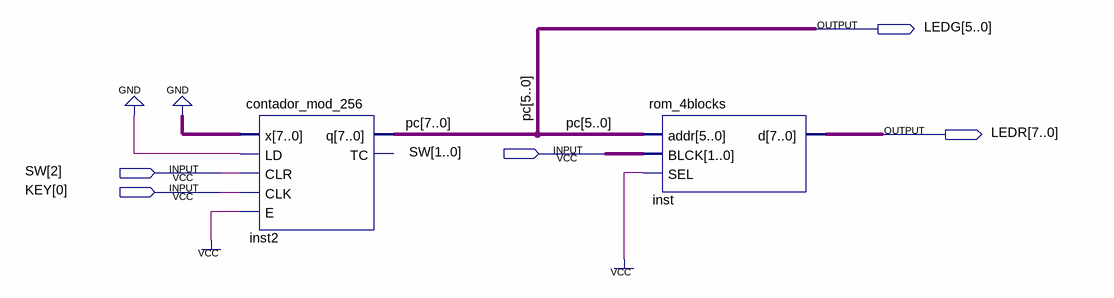
[diagram p0: schematic sheet]
// Quartus schematic teste_ROM.bdf as structural Verilog: 2 symbols, 5 pins
module teste_ROM (
  input  [2:0] SW,
  input  [0:0] KEY,
  output [5:0] LEDG,
  output [7:0] LEDR
);

  wire [7:6] pc;

  contador_mod_256 inst2 (.x({8{1'b0}}), .LD(1'b0), .CLR(SW[2]), .CLK(KEY[0]), .E(1'b1), .q({pc, LEDG}));  // open: TC
  rom_4blocks inst (.addr(LEDG), .SEL(1'b1), .BLCK(SW[1:0]), .d(LEDR));

  // Other names for the same wires on the sheet: pc[5:0] = LEDG
endmodule
